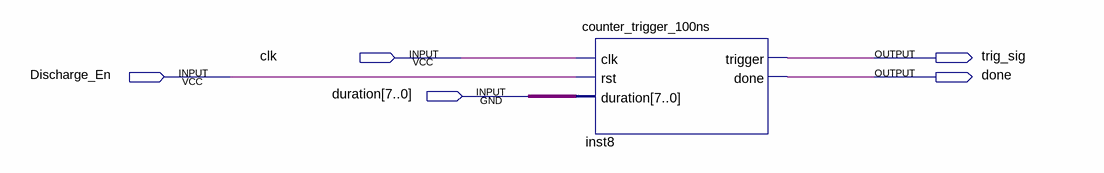
[diagram p0: schematic sheet]
// Quartus schematic Discharging.bdf as structural Verilog: 1 symbols, 5 pins
module Discharging (
  input  clk,
  input  Discharge_En,
  input  [7:0] duration,
  output trig_sig,
  output done
);

  counter_trigger_100ns inst8 (.clk(clk), .rst(Discharge_En), .duration(duration), .trigger(trig_sig), .done(done));
endmodule
